# Altium schematic sheet ExBoard.SchDoc
size A4; SheetNumber: 1; SheetTotal: 1
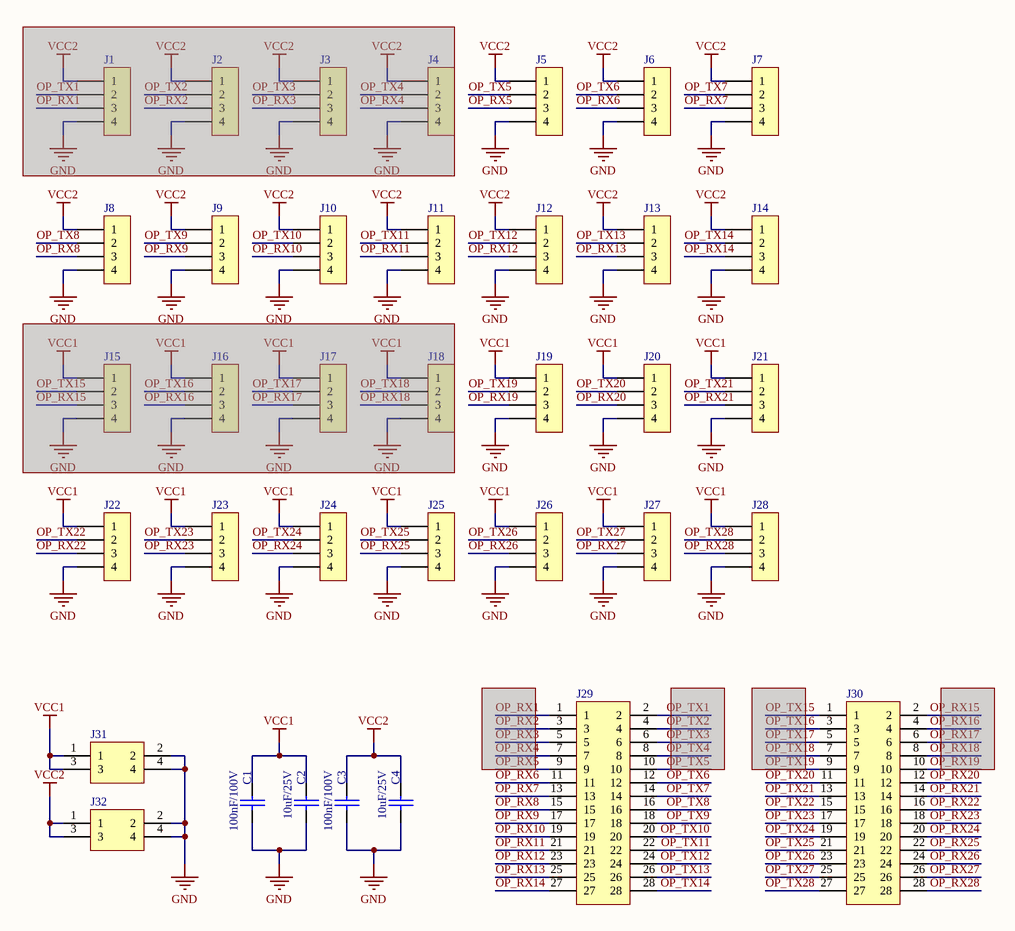
[diagram p0: ExBoard.SchDoc]

## Parts
C1  100nF/100V  [0603C]
C2  10uF/25V  [0603C]
C3  100nF/100V  [0603C]
C4  10uF/25V  [0603C]
J1  Female HDR1X4  [Fe-HDR1X4/2.54-S]  (value not drawn)  (masked out: inside a compile mask, not in the netlist)
J2  Female HDR1X4  [Fe-HDR1X4/2.54-S]  (value not drawn)  (masked out: inside a compile mask, not in the netlist)
J3  Female HDR1X4  [Fe-HDR1X4/2.54-S]  (value not drawn)  (masked out: inside a compile mask, not in the netlist)
J4  Female HDR1X4  [Fe-HDR1X4/2.54-S]  (value not drawn)  (masked out: inside a compile mask, not in the netlist)
J5  Female HDR1X4  [Fe-HDR1X4/2.54-S]  (value not drawn)
J6  Female HDR1X4  [Fe-HDR1X4/2.54-S]  (value not drawn)
J7  Female HDR1X4  [Fe-HDR1X4/2.54-S]  (value not drawn)
J8  Female HDR1X4  [Fe-HDR1X4/2.54-S]  (value not drawn)
J9  Female HDR1X4  [Fe-HDR1X4/2.54-S]  (value not drawn)
J10  Female HDR1X4  [Fe-HDR1X4/2.54-S]  (value not drawn)
J11  Female HDR1X4  [Fe-HDR1X4/2.54-S]  (value not drawn)
J12  Female HDR1X4  [Fe-HDR1X4/2.54-S]  (value not drawn)
J13  Female HDR1X4  [Fe-HDR1X4/2.54-S]  (value not drawn)
J14  Female HDR1X4  [Fe-HDR1X4/2.54-S]  (value not drawn)
J15  Female HDR1X4  [Fe-HDR1X4/2.54-S]  (value not drawn)  (masked out: inside a compile mask, not in the netlist)
J16  Female HDR1X4  [Fe-HDR1X4/2.54-S]  (value not drawn)  (masked out: inside a compile mask, not in the netlist)
J17  Female HDR1X4  [Fe-HDR1X4/2.54-S]  (value not drawn)  (masked out: inside a compile mask, not in the netlist)
J18  Female HDR1X4  [Fe-HDR1X4/2.54-S]  (value not drawn)  (masked out: inside a compile mask, not in the netlist)
J19  Female HDR1X4  [Fe-HDR1X4/2.54-S]  (value not drawn)
J20  Female HDR1X4  [Fe-HDR1X4/2.54-S]  (value not drawn)
J21  Female HDR1X4  [Fe-HDR1X4/2.54-S]  (value not drawn)
J22  Female HDR1X4  [Fe-HDR1X4/2.54-S]  (value not drawn)
J23  Female HDR1X4  [Fe-HDR1X4/2.54-S]  (value not drawn)
J24  Female HDR1X4  [Fe-HDR1X4/2.54-S]  (value not drawn)
J25  Female HDR1X4  [Fe-HDR1X4/2.54-S]  (value not drawn)
J26  Female HDR1X4  [Fe-HDR1X4/2.54-S]  (value not drawn)
J27  Female HDR1X4  [Fe-HDR1X4/2.54-S]  (value not drawn)
J28  Female HDR1X4  [Fe-HDR1X4/2.54-S]  (value not drawn)
J29  Female HDR2X14  [Fe-HDR2X14/2.54-S]  (value not drawn)
J30  Female HDR2X14  [Fe-HDR2X14/2.54-S]  (value not drawn)
J31  Female HDR2X2  [Fe-HDR2X2/2.54-S]  (value not drawn)
J32  Female HDR2X2  [Fe-HDR2X2/2.54-S]  (value not drawn)

## Nets
GND: C1.1 C2.2 C3.1 C4.2 J5.4 J6.4 J7.4 J8.4 J9.4 J10.4 J11.4 J12.4 J13.4 J14.4 J19.4 J20.4 J21.4 J22.4 J23.4 J24.4 J25.4 J26.4 J27.4 J28.4 J31.2 J31.4 J32.2 J32.4
VCC1: C1.2 C2.1 J19.1 J20.1 J21.1 J22.1 J23.1 J24.1 J25.1 J26.1 J27.1 J28.1 J31.1 J31.3
VCC2: C3.2 C4.1 J5.1 J6.1 J7.1 J8.1 J9.1 J10.1 J11.1 J12.1 J13.1 J14.1 J32.1 J32.3
OP_RX5: J5.3
OP_RX6: J6.3 J29.11
OP_RX7: J7.3 J29.13
OP_RX8: J8.3 J29.15
OP_RX9: J9.3 J29.17
OP_RX10: J10.3 J29.19
OP_RX11: J11.3 J29.21
OP_RX12: J12.3 J29.23
OP_RX13: J13.3 J29.25
OP_RX14: J14.3 J29.27
OP_RX19: J19.3
OP_RX20: J20.3 J30.12
OP_RX21: J21.3 J30.14
OP_RX22: J22.3 J30.16
OP_RX23: J23.3 J30.18
OP_RX24: J24.3 J30.20
OP_RX25: J25.3 J30.22
OP_RX26: J26.3 J30.24
OP_RX27: J27.3 J30.26
OP_RX28: J28.3 J30.28
OP_TX5: J5.2
OP_TX6: J6.2 J29.12
OP_TX7: J7.2 J29.14
OP_TX8: J8.2 J29.16
OP_TX9: J9.2 J29.18
OP_TX10: J10.2 J29.20
OP_TX11: J11.2 J29.22
OP_TX12: J12.2 J29.24
OP_TX13: J13.2 J29.26
OP_TX14: J14.2 J29.28
OP_TX19: J19.2
OP_TX20: J20.2 J30.11
OP_TX21: J21.2 J30.13
OP_TX22: J22.2 J30.15
OP_TX23: J23.2 J30.17
OP_TX24: J24.2 J30.19
OP_TX25: J25.2 J30.21
OP_TX26: J26.2 J30.23
OP_TX27: J27.2 J30.25
OP_TX28: J28.2 J30.27

Not connected (* = marked no-connect by the designer): J29 1 2 3 4 5 6 7 8 9 10; J30 1 2 3 4 5 6 7 8 9 10

## Library data of the parts
C1 C3 = CAP: CC0603KRX7R9BB104
C2 C4 = CAP: CC0603MRX5R8BB106